# Altium project Motor_Driver_Board_V1.0.PrjPCB
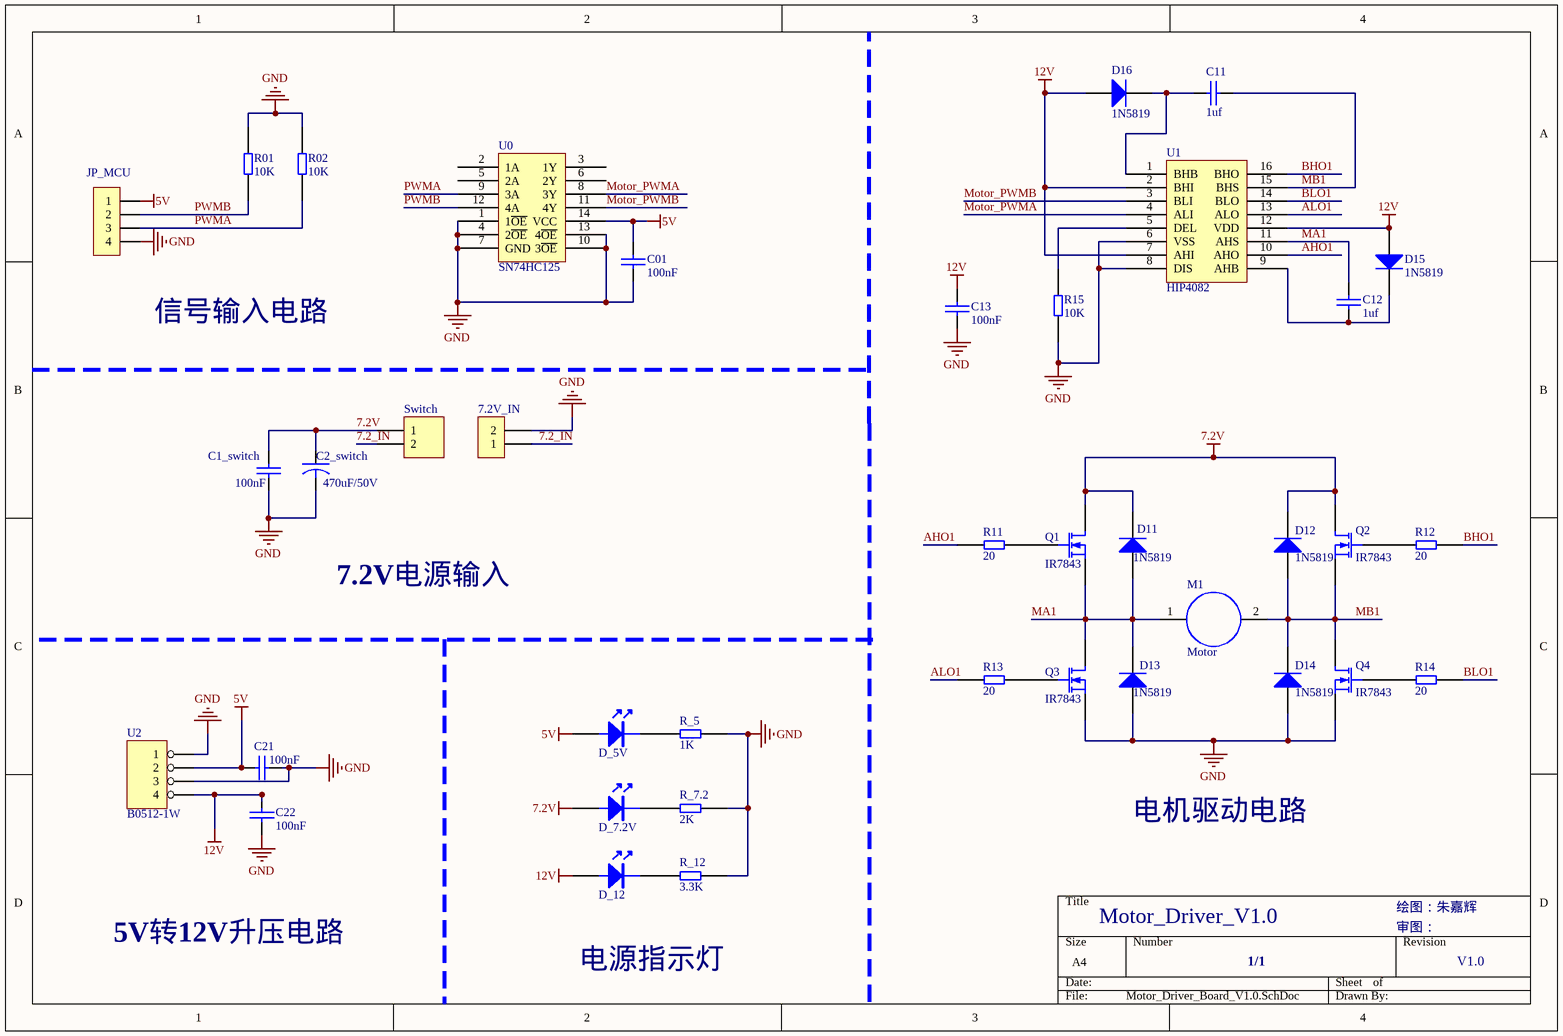
[diagram p0: Motor_Driver_Board_V1.0.SchDoc]
1 sheet, 38 parts. Net scope: global (net labels, ports and power ports of the same name join across sheets).
Board files: Motor_Driver_Board_V1.0.PcbDoc, Motor_Driver_Board_poly_V1.0.PcbDoc

## Sheet Motor_Driver_Board_V1.0.SchDoc
size A4

### Parts
7.2V_IN  CON2  [KF301-2P]  (value not drawn)
C01  100nF  [0805C]
C1_switch  100nF  [0805C]
C2_switch  470uF/50V  [RB.2/.4]
C11  1uf  [0805C]
C12  1uf  [0805C]
C13  100nF  [0805C]
C21  100nF  [0805C]
C22  100nF  [0805C]
D11  1N5819  [1N5819]
D12  1N5819  [1N5819]
D13  1N5819  [1N5819]
D14  1N5819  [1N5819]
D15  1N5819  [1N5819]
D16  1N5819  [1N5819]
D_5V  LED  [1206LED]  (value not drawn)
D_7.2V  LED  [1206LED]  (value not drawn)
D_12  LED  [1206LED]  (value not drawn)
JP_MCU  HDR-1X4  [XH2.54-WI-4P]  (value not drawn)
M1  Motor  [KF301-2P]
Q1  IR7843  [LR7843]
Q2  IR7843  [LR7843]
Q3  IR7843  [LR7843]
Q4  IR7843  [LR7843]
R01  10K  [0805]
R02  10K  [0805]
R11  20  [0805]
R12  20  [0805]
R13  20  [0805]
R14  20  [0805]
R15  10K  [0805]
R_5  1K  [0805]
R_7.2  2K  [0805]
R_12  3.3K  [0805]
Switch  Header 2  [SWITCH-MINI]  (value not drawn)
U0  SN74HC125  [SOP14_N]
U1  HIP4082  [SOP16_N]
U2  B0512-1W  [SIP4_B_S-1W]

### Nets
5V: C01.2 C21.1 D_5V.A JP_MCU.1 U0.14(VCC) U2.2
7.2V: C1_switch.1 C2_switch.1 D11.2(K) D12.2(K) D_7.2V.A Q1.1(D) Q2.1(D) Switch.1
12V: C13.1 C22.2 D15.1(A) D16.1(A) D_12.A U1.2(BHI) U1.7(AHI) U1.12(VDD) U2.4
GND: 7.2V_IN.2 C01.1 C1_switch.2 C2_switch.2 C13.2 C21.2 C22.1 D13.1(A) D14.1(A) JP_MCU.4 Q3.3(S) Q4.3(S) R01.2 R02.2 R15.1 R_5.1 R_7.2.1 R_12.1 U0.1(1~{OE}) U0.4(2~{OE}) U0.7(GND) U0.10(3~{OE}) U0.13(4~{OE}) U1.6(VSS) U1.8(DIS) U2.1 U2.3
7.2_IN: 7.2V_IN.1 Switch.2
AHO1: R11.1 U1.10(AHO)
ALO1: R13.1 U1.13(ALO)
BHO1: R12.2 U1.16(BHO)
BLO1: R14.2 U1.14(BLO)
MA1: C12.2 D11.1(A) D13.2(K) M1.1 Q1.3(S) Q3.1(D) U1.11(AHS)
MB1: C11.2 D12.1(A) D14.2(K) M1.2 Q2.3(S) Q4.1(D) U1.15(BHS)
Motor_PWMA: U0.8(3Y) U1.4(ALI)
Motor_PWMB: U0.11(4Y) U1.3(BLI)
PWMA: JP_MCU.3 R02.1 U0.9(3A)
PWMB: JP_MCU.2 R01.1 U0.12(4A)
NetC11_1: C11.1 D16.2(K) U1.1(BHB)
NetC12_1: C12.1 D15.2(K) U1.9(AHB)
NetQ1_2: Q1.2(G) R11.2
NetQ2_2: Q2.2(G) R12.1
NetQ3_2: Q3.2(G) R13.2
NetQ4_2: Q4.2(G) R14.1
NetR15_2: R15.2 U1.5(DEL)

Not connected (* = marked no-connect by the designer): D_5V K(2); D_7.2V K(2); D_12 K(2); R_5 2; R_7.2 2; R_12 2; U0 2(1A) 3(1Y) 5(2A) 6(2Y)

### Notes on the sheet
- 信号输入电路
- 7.2V电源输入
- 电机驱动电路
- Motor_Driver_V1.0
- 绘图：朱嘉辉
- 5V转12V升压电路
- 电源指示灯
- 1/1
- 审图：
- V1.0

### Library data of the parts
7.2V_IN = CON2: Connector
C01 C1_switch C11-C13 C21 C22 = CAP: Capacitor
C2_switch = CAPACITOR
D11-D16 = Diode: Default Diode; Published: 8-Jun-2000; LatestRevisionDate: 17-Jul-2002; LatestRevisionNote: Re-released for DXP Platform.; PackageVersion: Sep-1996; PackageReference: SMC; Publisher: Altium Limited; PackageDescription: DO-214-AB/SMC; 2 C-Bend Leads; Body 7.9 x 5.9 mm, inc. leads (LxW); Code_JEDEC: DO-214-AB
JP_MCU = Header 4: 4P接插件; 版权归属: 封装库来自淘宝 ID：黄晶宝石; BOM名称: 4P接插件; 学习资源: https://shop463601444.taobao.com
M1 = METER: pin to pad: 1>2 2>1
Q1-Q4 = MOSFET-N: N-Channel MOSFET; Published: 8-Jun-2000; LatestRevisionDate: 17-Jul-2002; LatestRevisionNote: Re-released for DXP Platform.; PackageVersion: 1995/1996; PackageReference: E3; Publisher: Altium Limited; PackageDescription: TO, Flat Index; 3 In-Line, Axial Leads; Body Dia. 4.6mm; Lead Dia. 0.5 mm (max)
R01 R02 R11-R15 R_5 R_7.2 R_12 = RES
Switch = Header 2: Header, 2-Pin; LatestRevisionDate: 17-Jul-2002; LatestRevisionNote: Re-released for DXP Platform.; Publisher: Altium Limited
U0 = SN74LVC125
U2 = 4 HEADER: 4 Pin Header